# Altium schematic sheet Top_level.SchDoc
size A
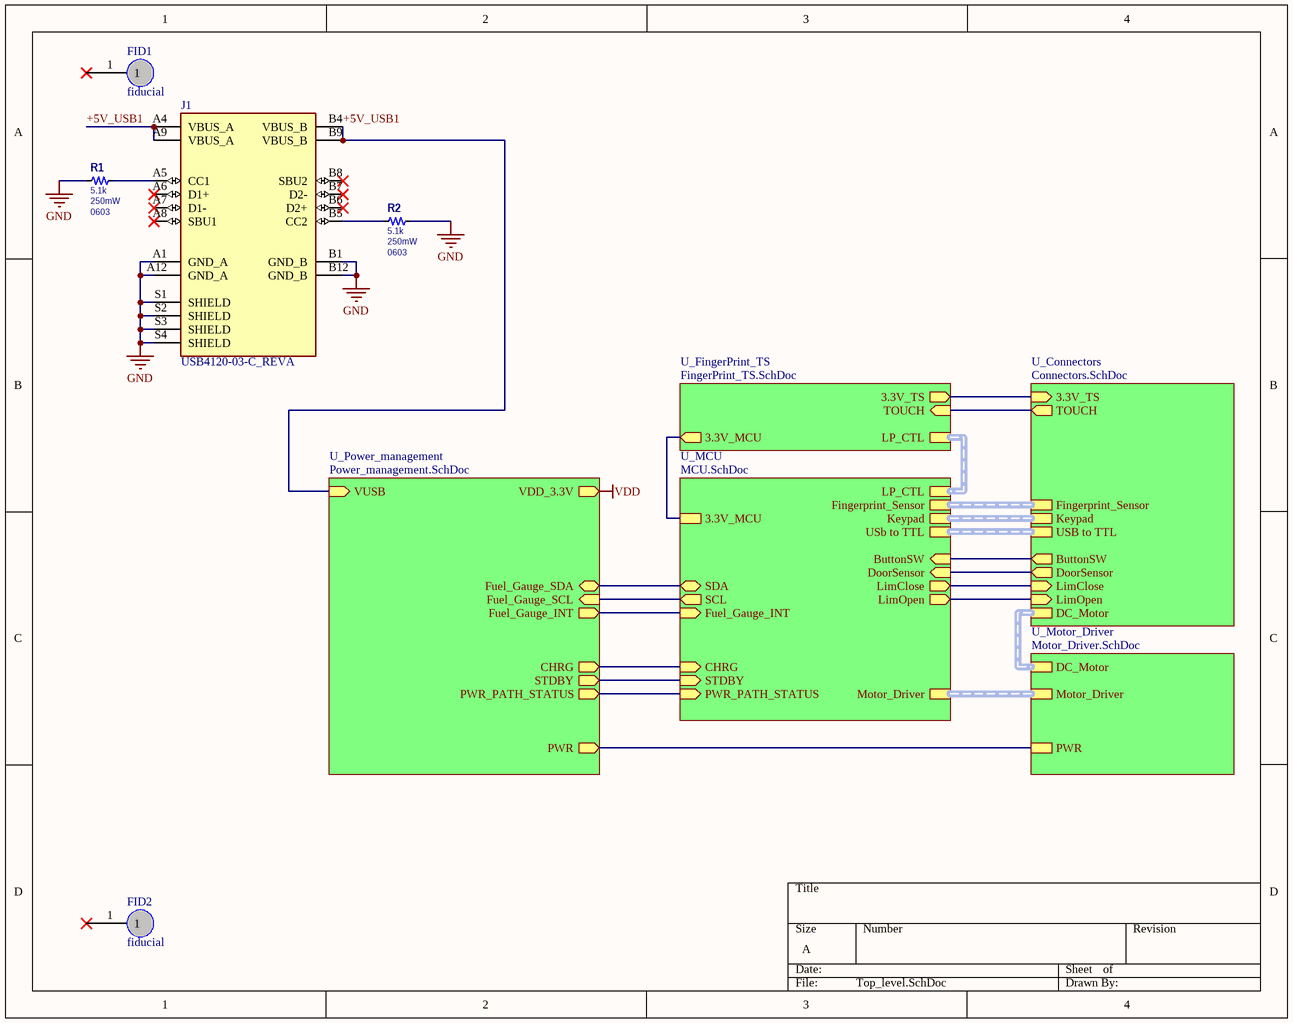
[diagram p0: Top_level.SchDoc]

## Parts
FID1  fiducial  [Fiducial]
FID2  fiducial  [Fiducial]
J1  USB4120-03-C_REVA  [GCT_USB4120-03-C_REVA]
R1  5.1k  Power Rating: 250mW  Case/Package: 0603  [0603-R]
R2  5.1k  Power Rating: 250mW  Case/Package: 0603  [0603-R]

## Sub-sheets
U_Connectors = Connectors.SchDoc: Keypad (harness Keypad), Fingerprint_Sensor (harness Fingerprint_Sensor), DC_Motor (harness DC_Motor), TOUCH (out), 3.3V_TS (in), USB to TTL (harness USB to TTL), LimClose (in), LimOpen (in), DoorSensor (out), ButtonSW (out)
U_FingerPrint_TS = FingerPrint_TS.SchDoc: 3.3V_MCU (out), LP_CTL (harness LP_CTL), TOUCH (in), 3.3V_TS (out)
U_MCU = MCU.SchDoc: Keypad (harness Keypad), Fingerprint_Sensor (harness Fingerprint_Sensor), Motor_Driver (harness Motor_Driver), SDA (bidir), SCL (out), Fuel_Gauge_INT (in), LP_CTL (harness LP_CTL), 3.3V_MCU, PWR_PATH_STATUS (in), CHRG (in), STDBY (in), USb to TTL (harness USB to TTL), LimClose (out), LimOpen (out), DoorSensor (in), ButtonSW (in)
U_Motor_Driver = Motor_Driver.SchDoc: Motor_Driver (harness Motor_Driver), DC_Motor (harness DC_Motor), PWR
U_Power_management = Power_management.SchDoc: CHRG (out), STDBY (out), Fuel_Gauge_SDA (bidir), Fuel_Gauge_SCL (in), Fuel_Gauge_INT (out), PWR_PATH_STATUS (out), PWR (out), VUSB (in), VDD_3.3V (out)

## Nets
GND: J1.A1(GND_A) J1.A12(GND_A) J1.B1(GND_B) J1.B12(GND_B) J1.S1(SHIELD) J1.S2(SHIELD) J1.S3(SHIELD) J1.S4(SHIELD) R1.1 R2.2
VDD: sheet U_Power_management/VDD_3.3V
+5V_USB1: J1.A4(VBUS_A) J1.A9(VBUS_A) J1.B4(VBUS_B) J1.B9(VBUS_B) ; sheet U_Power_management/VUSB
NetJ1_A5: J1.A5(CC1) R1.2
NetJ1_B5: J1.B5(CC2) R2.1
(unnamed): sheet U_MCU/SDA, sheet U_Power_management/Fuel_Gauge_SDA
(unnamed): sheet U_MCU/SCL, sheet U_Power_management/Fuel_Gauge_SCL
(unnamed): sheet U_MCU/Fuel_Gauge_INT, sheet U_Power_management/Fuel_Gauge_INT
(unnamed): sheet U_MCU/3.3V_MCU, sheet U_FingerPrint_TS/3.3V_MCU
(unnamed): sheet U_MCU/PWR_PATH_STATUS, sheet U_Power_management/PWR_PATH_STATUS
(unnamed): sheet U_MCU/CHRG, sheet U_Power_management/CHRG
(unnamed): sheet U_MCU/STDBY, sheet U_Power_management/STDBY
(unnamed): sheet U_MCU/LimClose, sheet U_Connectors/LimClose
(unnamed): sheet U_MCU/LimOpen, sheet U_Connectors/LimOpen
(unnamed): sheet U_MCU/DoorSensor, sheet U_Connectors/DoorSensor
(unnamed): sheet U_MCU/ButtonSW, sheet U_Connectors/ButtonSW
(unnamed): sheet U_Connectors/TOUCH, sheet U_FingerPrint_TS/TOUCH
(unnamed): sheet U_Connectors/3.3V_TS, sheet U_FingerPrint_TS/3.3V_TS
(unnamed): sheet U_Motor_Driver/PWR, sheet U_Power_management/PWR

Not connected (* = marked no-connect by the designer): FID1 1*; FID2 1*; J1 A6(D1+)* A7(D1-)* A8(SBU1)* B6(D2+)* B7(D2-)* B8(SBU2)*

## Buses and harness runs
harness sheet U_Connectors/DC_Motor = sheet U_Motor_Driver/DC_Motor
harness sheet U_Connectors/Fingerprint_Sensor = sheet U_MCU/Fingerprint_Sensor
harness sheet U_Connectors/Keypad = sheet U_MCU/Keypad
harness sheet U_Connectors/USB to TTL = sheet U_MCU/USb to TTL
harness sheet U_FingerPrint_TS/LP_CTL = sheet U_MCU/LP_CTL
harness sheet U_MCU/Motor_Driver = sheet U_Motor_Driver/Motor_Driver

## Library data of the parts
J1 = USB4120-03-C_REVA: MF: Global Connector Technology; SnapEDA_Link: https://www.snapeda.com/parts/USB4120-03-C/Global%20Connector%20Technology/view-part/5160677/?ref=snap; Package: None; Check_prices: https://www.snapeda.com/parts/USB4120-03-C/Global%20Connector%20Technology/view-part/5160677/?ref=eda; MP: USB4120-03-C; Value: *; Availability: Unavailable; Price: None
R1 R2 = Res: Manufacturer: Panasonic; Manufacturer Part Number: ERJ-8GEYJ621V; Resistance: 620R; Tolerance: 5%; Voltage Rating: 200V; Temperature Coefficient: 200ppm/°C; ComponentLink1URL: https://datasheet.ciiva.com/15193/getdatasheetpartid-366470-15193725.pdf?src-supplier=Verical; ComponentLink1Description: Datasheet; Supplier 1: Avnet; Stock 1: 6255; Pricing 1: 1 = 0.01200 (USD); RoHS: Yes; Mount: Surface Mount; Case Code (Metric): 3216; Case Code (Imperial): 1206; Contact Plating: Tin; Min Operating Temperature: -55°C; Max Operating Temperature: 155°C; Packaging: Tape and Reel; Package Quantity: 1; Resistor Type: Thick Film; Number of Terminations: 2; Max Power Dissipation: 250mW; Voltage Rating (DC): 200V; Features: Automotive AEC-Q200; Series: ERJ; Construction: Rectangular; Resistance Tolerance: 5%; Length: 3.2mm; Width: 0.063inch; Height: 0.028inch; Depth: 1.6mm; Radiation Hardening: No; REACH SVHC: No SVHC; Military Standard: Not; Lead Free: Lead Free; RoHS Compliant: Yes; ComponentLink2URL: https://datasheet.ciiva.com/46387/1500035-46387094.pdf?src-supplier=Element14; ComponentLink2Description: https://datasheet.ciiva.com/46387/1500035-46387094.pdf?src-supplier=Element14; ComponentLink3URL: https://datasheet.ciiva.com/5915/1500035-5915369.pdf?src-supplier=Farnell; ComponentLink3Description: https://datasheet.ciiva.com/5915/1500035-5915369.pdf?src-supplier=Farnell; ComponentLink4URL: https://datasheet.ciiva.com/28677/1678796-28677018.pdf?src-supplier=Element14; ComponentLink4Description: https://datasheet.ciiva.com/28677/1678796-28677018.pdf?src-supplier=Element14; ComponentLink5URL: https://datasheet.ciiva.com/17204/aoa0000ce1-17204972.pdf?src-supplier=Avnet+Europe; ComponentLink5Description: https://datasheet.ciiva.com/17204/aoa0000ce1-17204972.pdf?src-supplier=Avnet+Europe; ComponentLink6URL: https://datasheet.ciiva.com/16515/aoa0000ce1-16515933.pdf?src-supplier=Avnet+Asia; ComponentLink6Description: https://datasheet.ciiva.com/16515/aoa0000ce1-16515933.pdf?src-supplier=Avnet+Asia; Supplier Part Number 1: 65T8955